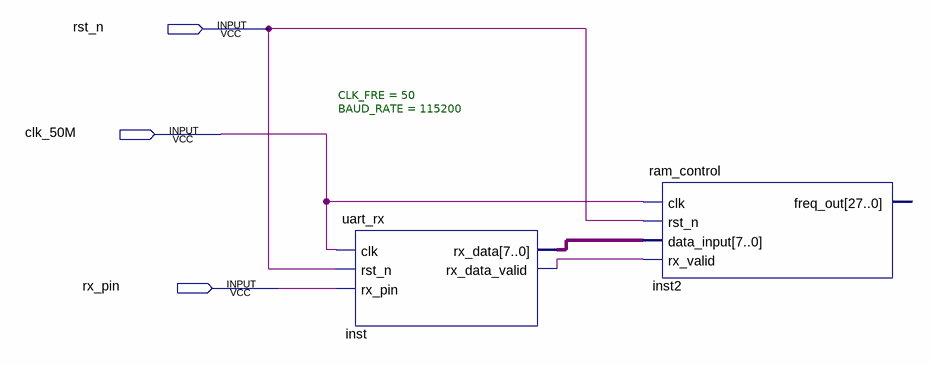
[diagram p0: schematic sheet]
// Quartus schematic fpga_project.bdf as structural Verilog: 2 symbols, 3 pins
module fpga_project (
  input  rst_n,
  input  clk_50M,
  input  rx_pin
);

  wire inst_rx_data_valid;
  wire [7:0] inst_rx_data;

  uart_rx #(.CLK_FRE(50), .BAUD_RATE(115200)) inst (
    .clk(clk_50M), .rst_n(rst_n), .rx_pin(rx_pin), .rx_data(inst_rx_data), .rx_data_valid(inst_rx_data_valid));
  ram_control inst2 (
    .clk(clk_50M), .rst_n(rst_n), .data_input(inst_rx_data), .rx_valid(inst_rx_data_valid));  // open: freq_out
endmodule
